# EAGLE schematic Main_LEFT (EAGLE 9.2.2)
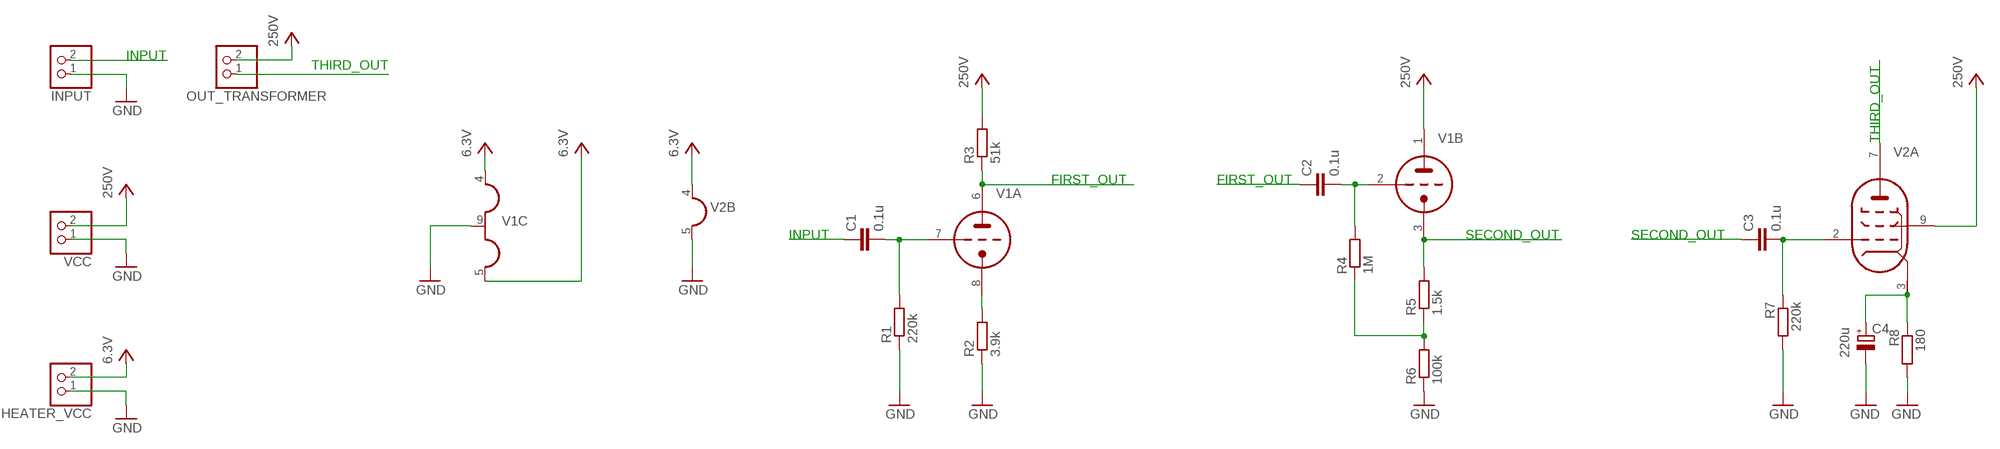
[diagram p0: schematic, sheet 1]

## Parts
C1  0.1u  C  [C025-025X050]
C2  0.1u  C  [C025-025X050]
C3  0.1u  C  [C025-025X050]
C4  220u  CAPACITOR2  [E2,5-6]
HEATER_VCC  PINHD-1X2  [1X02]
INPUT  PINHD-1X2  [1X02]
OUT_TRANSFORMER  PINHD-1X2  [1X02]
R1  220k  RESISTOR2  [0207/7]
R2  3.9k  RESISTOR2  [0207/7]
R3  51k  RESISTOR2  [0207/7]
R4  1M  RESISTOR2  [0207/7]
R5  1.5k  RESISTOR2  [0207/7]
R6  100k  RESISTOR2  [0207/7]
R7  220k  RESISTOR2  [0207/7]
R8  180  RESISTOR2  [0207/7]
V1  AT-MT9P(12AX7)  [AT-MT9P]
V2  AT-MT9P(6BQ5)  [AT-MT9P]
VCC  PINHD-1X2  [1X02]

## Nets
GND: C4.- HEATER_VCC.1 INPUT.1 R1.1 R2.1 R6.1 R7.2 R8.2 V1.9(C:H2) V2.5(B:H2) VCC.1
N$1: R3.1 V1.6(A:TA)
N$2: R2.2 V1.8(A:TK)
N$4: INPUT.2
N$5: C1.2 R1.2 V1.7(A:TG)
N$6: R5.2 V1.3(B:TK)
N$7: C1.1
N$8: R4.1 R5.1 R6.2
N$9: C2.2 R4.2 V1.2(B:TG)
N$10: C2.1
N$12: C3.1
N$13: C3.2 R7.1 V2.2(A:PG)
N$14: C4.+ R8.1 V2.3(A:PK)
N$15: V2.7(A:PA)
N$16: OUT_TRANSFORMER.1
N$17: V2.9(A:PSG) ; supply symbol labelled 250V
VCC: HEATER_VCC.2 OUT_TRANSFORMER.2 R3.2 V1.1(B:TA) V1.4(C:H1) V1.5(C:H3) V2.4(B:H1) VCC.2 ; supply symbol labelled 250V, 6.3V

## Notes on the sheet
- INPUT | THIRD_OUT
- THIRD_OUT
- FIRST_OUT | FIRST_OUT
- INPUT | SECOND_OUT | SECOND_OUT

## Library data of the parts
C1-C3 = VacuumTube:C
C4 = VacuumTube:CAPACITOR2
HEATER_VCC INPUT OUT_TRANSFORMER VCC = VacuumTube:PINHD-1X2: PIN HEADER
R1-R8 = VacuumTube:RESISTOR2
V1 = VacuumTube:AT-MT9P(12AX7)
V2 = VacuumTube:AT-MT9P(6BQ5)